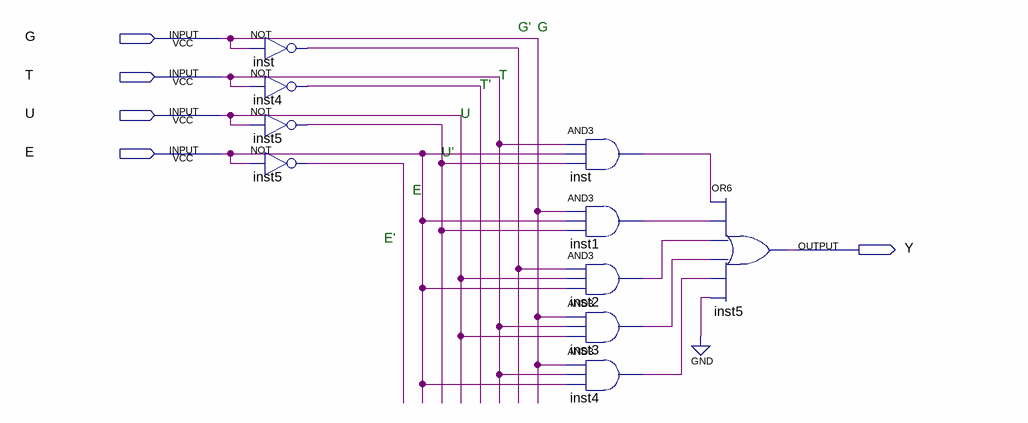
[diagram p0: schematic sheet]
// Quartus schematic lab1_g8_p2.bdf as structural Verilog: 10 symbols, 5 pins
module lab1_g8_p2 (
  input  G,
  input  T,
  input  U,
  input  E,
  output Y
);

  wire inst1_out, inst2_out, inst3_out, inst4_out, inst4_out_2, inst5_out, inst5_out_2, inst_out, inst_out_2;

  not inst (inst_out, G);
  not inst4 (inst4_out, T);
  not inst5 (inst5_out_2, U);
  not inst5_dup2 (inst5_out, E);
  and inst_dup2 (inst_out_2, T, E, inst5_out_2);
  and inst1 (inst1_out, G, E, inst5_out_2);
  and inst2 (inst2_out, inst_out, U, E);
  and inst3 (inst3_out, G, T, U);
  and inst4_dup2 (inst4_out_2, G, T, E);
  or inst5_dup3 (Y, inst_out_2, inst1_out, inst2_out, inst3_out, inst4_out_2, 1'b0);

  // Notes on the sheet:
  //   G'
  //   G
  //   T
  //   T'
  //   U
  //   U'
  //   E
  //   E'
endmodule
